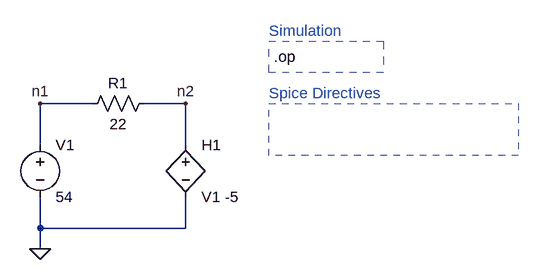
[diagram p0: schematic CCVS_h.asc]
CCVS_h.asc, the LTspice schematic file:
Version 4
SHEET 1 1432 696
WIRE 368 160 288 160
WIRE 512 160 448 160
WIRE 288 224 288 160
WIRE 512 224 512 160
WIRE 288 352 288 304
WIRE 512 352 512 304
WIRE 512 352 288 352
WIRE 288 384 288 352
FLAG 288 160 n1
FLAG 512 160 n2
FLAG 288 384 0
SYMBOL h 512 208 R0
SYMATTR InstName H1
SYMATTR Value V1 -5
SYMBOL voltage 288 208 R0
SYMATTR InstName V1
SYMATTR Value 54
SYMBOL res 464 144 R90
WINDOW 0 0 56 VBottom 2
WINDOW 3 32 56 VTop 2
SYMATTR InstName R1
SYMATTR Value 22
TEXT 640 48 Left 2 ;Simulation
TEXT 648 88 Left 2 !.op
TEXT 640 144 Left 2 ;Spice Directives
RECTANGLE Normal 816 112 640 64 2
RECTANGLE Normal 1024 240 640 160 2

The netlist it stands for:
* CCVS_h.asc
H1 n2 0 V1 -5
V1 n1 0 54
R1 n2 n1 22
* Simulation
.op
* Spice Directives
.backanno
.end